# EAGLE schematic STM32F100 Base Wireless_2 (EAGLE 6.5.0)
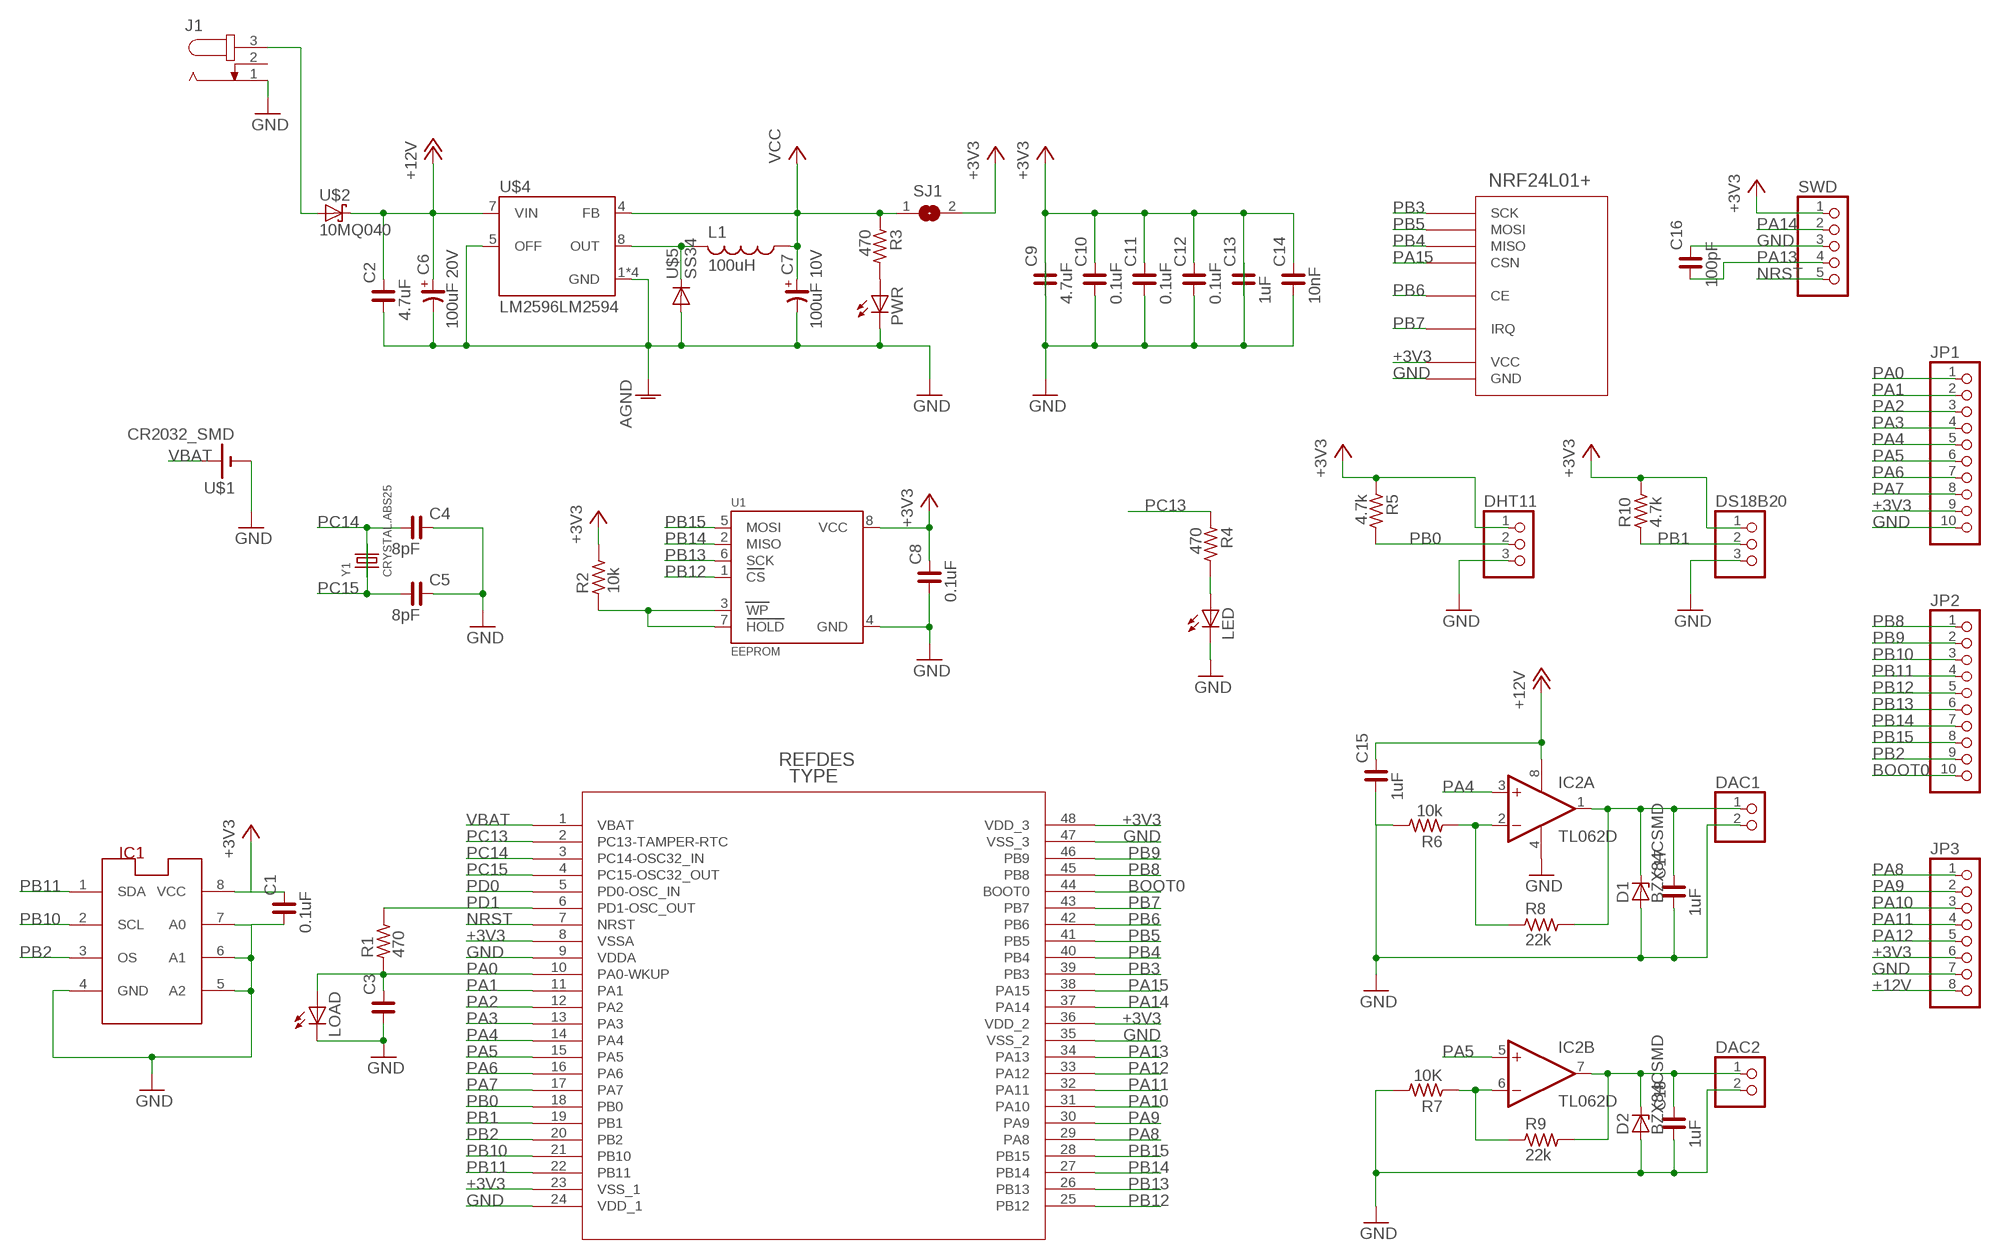
[diagram p0: schematic, sheet 1]

## Parts
C1  0.1uF  C_0603  [C0603]
C2  4.7uF  C_0603  [C0603]
C3  C_0603  [C0603]
C4  8pF  C_0603  [C0603]
C5  8pF  C_0603  [C0603]
C6  100uF 20V  CP_7343  [C7343/T]
C7  100uF 10V  CP_6032-28  [C6032-28/T]
C8  0.1uF  C_0603  [C0603]
C9  4.7uF  C_0603  [C0603]
C10  0.1uF  C_0603  [C0603]
C11  0.1uF  C_0603  [C0603]
C12  0.1uF  C_0603  [C0603]
C13  1uF  C_0603  [C0603]
C14  10nF  C_0603  [C0603]
C15  1uF  C_0603  [C0603]
C16  100pF  C_0603  [C0603]
C17  1uF  C_0603  [C0603]
C18  1uF  C_0603  [C0603]
D1  BZX84CSMD  [TO236]
D2  BZX84CSMD  [TO236]
DAC1  PINHD-1X02_2.54-S  [1X02-S]
DAC2  PINHD-1X02_2.54-S  [1X02-S]
DHT11  PINHD-1X03_2.54-S  [1X03-S]
DS18B20  PINHD-1X03_2.54-S  [1X03-S]
IC1  LM75_ICN  [SO8_LM75]
IC2  TL062D  [SO08]
J1  JACK-PLUG0  [SPC4077]
JP1  PINHD-1X10_2.54-S  [1X10-S]
JP2  PINHD-1X10_2.54-S  [1X10-S]
JP3  PINHD-1X08_2.54-S  [1X08-S]
L1  100uH  L-USWE-TPC  [POWER-CHOKE_WE-TPC]
LED  LEDCHIPLED_1206  [CHIPLED_1206]
LOAD  LEDCHIPLED_1206  [CHIPLED_1206]
PWR  LEDCHIPLED_1206  [CHIPLED_1206]
R1  470  R_1206  [R1206]
R2  10k  R_1206  [R1206]
R3  470  R_1206  [R1206]
R4  470  R_1206  [R1206]
R5  4.7k  R_1206  [R1206]
R6  10k  R_1206  [R1206]
R7  10K  R_1206  [R1206]
R8  22k  R_1206  [R1206]
R9  22k  R_1206  [R1206]
R10  4.7k  R_1206  [R1206]
SJ1  SJ  [SJ]
SWD  PINHD-1X05_2.54-90°-S  [1X05/90-S]
U1  EEPROM  EEPROM_SPI_AT25040A  [SOIC8_150MIL]
U$1  CR2032_SMD  [SMD_BH-2]
U$2  10MQ040  [SMA]
U$3  STM32F100C8T6B  [LQFP-48]
U$4  LM2596LM2594  [SOIC8_150MIL]
U$5  SS34  DIODE-DO214AC  [DO214AC]
U$6  NRF24L01+  [NRF24L01+]
Y1  CRYSTAL.ABS25  [ABS25]

## Nets
+3V3: C1.2 C8.2 C9.1 C10.2 C11.2 C12.2 C13.1 C14.2 DHT11.1 DS18B20.1 IC1.8(VCC) JP1.9 JP3.6 R2.2 R5.1 R10.2 SJ1.2 SWD.1 U1.8(VCC) U$3.8(VSSA) U$3.23(VSS_1) U$3.36(VDD_2) U$3.48(VDD_3) U$6.VCC
+12V: C2.2 C6.+ C15.2 IC2.8(P:V+) JP3.8 U$2.C U$4.7(VIN)
BOOT0: JP2.10 U$3.44(BOOT0)
GND: C1.1 C2.1 C3.1 C4.2 C5.2 C6.- C7.- C8.1 C9.2 C10.1 C11.1 C12.1 C13.2 C14.1 C15.1 C16.2 C17.1 C18.1 D1.A D2.A DAC1.2 DAC2.2 DHT11.3 DS18B20.3 IC1.4(GND) IC1.5(A2) IC1.6(A1) IC1.7(A0) IC2.4(P:V-) J1.1 JP1.10 JP3.7 LED.C LOAD.C PWR.C R6.2 R7.2 SWD.3 U1.4(GND) U$1.P$NEG(-) U$3.9(VDDA) U$3.24(VDD_1) U$3.35(VSS_2) U$3.47(VSS_3) U$4.1(GND) U$4.2(GND) U$4.3(GND) U$4.5(OFF) U$4.6(GND) U$5.A U$6.GND ; supply symbol labelled AGND
IN_12V: J1.3 U$2.A
LM_OUT: L1.2 U$4.8(OUT) U$5.C
LM_VCC: C7.+ L1.1 R3.1 SJ1.1 U$4.4(FB) ; supply symbol labelled VCC
N$1: C17.2 D1.C DAC1.1 IC2.1(A:OUT) R8.2
N$2: PWR.A R3.2
N$3: IC2.2(A:-IN) R6.1 R8.1
N$4: IC2.6(B:-IN) R7.1 R9.1
N$5: C18.2 D2.C DAC2.1 IC2.7(B:OUT) R9.2
N$6: LED.A R4.2
N$10: R2.1 U1.3(WP) U1.7(HOLD)
NRST: SWD.5 U$3.7(NRST)
PA0: C3.2 JP1.1 LOAD.A R1.1 U$3.10(PA0-WKUP)
PA1: JP1.2 U$3.11(PA1)
PA2: JP1.3 U$3.12(PA2)
PA3: JP1.4 U$3.13(PA3)
PA4: IC2.3(A:+IN) JP1.5 U$3.14(PA4)
PA5: IC2.5(B:+IN) JP1.6 U$3.15(PA5)
PA6: JP1.7 U$3.16(PA6)
PA7: JP1.8 U$3.17(PA7)
PA8: JP3.1 U$3.29(PA8)
PA9: JP3.2 U$3.30(PA9)
PA10: JP3.3 U$3.31(PA10)
PA11: JP3.4 U$3.32(PA11)
PA12: JP3.5 U$3.33(PA12)
PA13: C16.1 SWD.4 U$3.34(PA13)
PA14: SWD.2 U$3.37(PA14)
PA15: U$3.38(PA15) U$6.CSN
PB0: DHT11.2 R5.2 U$3.18(PB0)
PB1: DS18B20.2 R10.1 U$3.19(PB1)
PB2: IC1.3(OS) JP2.9 U$3.20(PB2)
PB3: U$3.39(PB3) U$6.SCK
PB4: U$3.40(PB4) U$6.MISO
PB5: U$3.41(PB5) U$6.MOSI
PB6: U$3.42(PB6) U$6.CE
PB7: U$3.43(PB7) U$6.IRQ
PB8: JP2.1 U$3.45(PB8)
PB9: JP2.2 U$3.46(PB9)
PB10: IC1.2(SCL) JP2.3 U$3.21(PB10)
PB11: IC1.1(SDA) JP2.4 U$3.22(PB11)
PB12: JP2.5 U1.1(CS) U$3.25(PB12)
PB13: JP2.6 U1.6(SCK) U$3.26(PB13)
PB14: JP2.7 U1.2(MISO) U$3.27(PB14)
PB15: JP2.8 U1.5(MOSI) U$3.28(PB15)
PC13: R4.1 U$3.2(PC13-TAMPER-RTC)
PC14: C4.1 U$3.3(PC14-OSC32_IN) Y1.1
PC15: C5.1 U$3.4(PC15-OSC32_OUT) Y1.4
PD0: U$3.5(PD0-OSC_IN)
PD1: R1.2 U$3.6(PD1-OSC_OUT)
VBAT: U$1.P$POS1(+) U$3.1(VBAT)
Unconnected: J1.2

## Library data of the parts
C1-C5 C8-C18 = rc-master-smd:C_: NON-POLARIZED CAP
C6 C7 = rc-master-smd:CP_: POLARIZED CAP
D1 D2 = diode:BZX84CSMD: Z DIODE
DAC1 DAC2 = pinhead-2:PINHD-1X02: PIN HEADER
DHT11 DS18B20 = pinhead-2:PINHD-1X03: PIN HEADER
IC1 = lm75:LM75_IC: Temperatursensor
IC2 = linear:TL062: OP AMP
J1 = con-jack:JACK-PLUG: DC POWER JACK Power Jack, DC, Right Angle, Through Hole, Rated 5A at 16VDC, PC Terminals Distributor: Farnell (www.Farnell.de) Drawing: 84N1161.pdf / 84N1162.pdf Manufacturer: SPC Technology (www.spctechnology.com) Type: SPC4077 / SPC 4078; OC_FARNELL: unknown; OC_NEWARK: unknown
JP1 JP2 = pinhead-2:PINHD-1X10: PIN HEADER
JP3 = pinhead-2:PINHD-1X08: PIN HEADER
L1 = rcl:L-US: INDUCTOR, American symbol; SDR0604-470KL: 47uH
LED LOAD PWR = led:LED: LED OSRAM: - CHIPLED LG R971, LG N971, LY N971, LG Q971, LY Q971, LO R971, LY R971 LH N974, LH R974 LS Q976, LO Q976, LY Q976 LO Q996 - Hyper CHIPLED LW Q18S LB Q993, LB Q99A, LB R99A - SideLED LS A670, LO A670, LY A670, LG A670, LP A670 LB A673, LV A673, LT A673, LW A673 LH A674 LY A675 LS A676, LA A676, LO A676, LY A676, LW A676 LS A679, LY A679, LG A679 - Hyper Micro SIDELED® LS Y876, LA Y876, LO Y876, LY Y876 LT Y87S - SmartLED LW L88C, LW L88S LB L89C, LB L89S, LG L890 LS L89K, LO L89K, LY L89K LS L896, LA L896, LO L896, LY L896 - TOPLED LS T670, LO T670, LY T670, LG T670, LP T670 LSG T670, LSP T670, LSY T670, LOP T670, LYG T670 LG T671, LOG T671, LSG T671 LB T673, LV T673, LT T673, LW T673 LH T674 LS T676, LA T676, LO T676, LY T676, LB T676, LH T676, LSB T676, LW T676 LB T67C, LV T67C, LT T67C, LS T67K, LO T67K, LY T67K, LW E67C LS E67B, LA E67B, LO E67B, LY E67B, LB E67C, LV E67C, LT E67C LW T67C LS T679, LY T679, LG T679 LS T770, LO T770, LY T770, LG T770, LP T770 LB T773, LV T773, LT T773, LW T773 LH T774 LS E675, LA E675, LY E675, LS T675 LS T776, LA T776, LO T776, LY T776, LB T776 LHGB T686 LT T68C, LB T68C - Hyper Mini TOPLED® LB M676 - Mini TOPLED Santana® LG M470 LS M47K, LO M47K, LY M47K Source: http://www.osram.convergy.de LUXEON: - LUMILED® LXK2-PW12-R00, LXK2-PW12-S00, LXK2-PW14-U00, LXK2-PW14-V00 LXK2-PM12-R00, LXK2-PM12-S00, LXK2-PM14-U00 LXK2-PE12-Q00, LXK2-PE12-R00, LXK2-PE12-S00, LXK2-PE14-T00, LXK2-PE14-U00 LXK2-PB12-K00, LXK2-PB12-L00, LXK2-PB12-M00, LXK2-PB14-N00, LXK2-PB14-P00, LXK2-PB14-Q00 LXK2-PR12-L00, LXK2-PR12-M00, LXK2-PR14-Q00, LXK2-PR14-R00 LXK2-PD12-Q00, LXK2-PD12-R00, LXK2-PD12-S00 LXK2-PH12-R00, LXK2-PH12-S00 LXK2-PL12-P00, LXK2-PL12-Q00, LXK2-PL12-R00 Source: www.luxeon.com KINGBRIGHT: KA-3528ASYC Source: www.kingbright.com
R1-R10 = rc-master-smd:R_: RESISTOR
SJ1 = jumper:SJ: SMD solder JUMPER
SWD = pinhead-2:PINHD-1X05: PIN HEADER
U1 = my-library:EEPROM_SPI_AT25040A: AT25010a/40a EEPROM SOIC8 AT25010a, 1K (128 x 8 bit) - Digikey: AT25010AN-10SU2.7-ND AT25040a, 4K (256 x 8 bit) - Digikey: AT25040AN-10SU1.8-ND TSSOP8 AT25010a, 1K (128 x 8 bit) - Digikey: AT25010A-10TU-1.8-ND AT25040a, 4K (256 x 8 bit) - Digikey: AT25040A-10TU-1.8-ND
U$1 = my-library:CR2032_SMD
U$2 = my-library:10MQ040: SCHOTTKY
U$3 = STM32F1:STM32F100C8T6B
U$4 = my-library:LM2596: LM2596
U$5 = diode:DIODE-: DIODE
U$6 = my-library:NRF24L01+: NRF24L01+ wireless data transmission module 2.4G
Y1 = abracon:CRYSTAL